# Altium schematic sheet PressureTransducer.SchDoc
size A
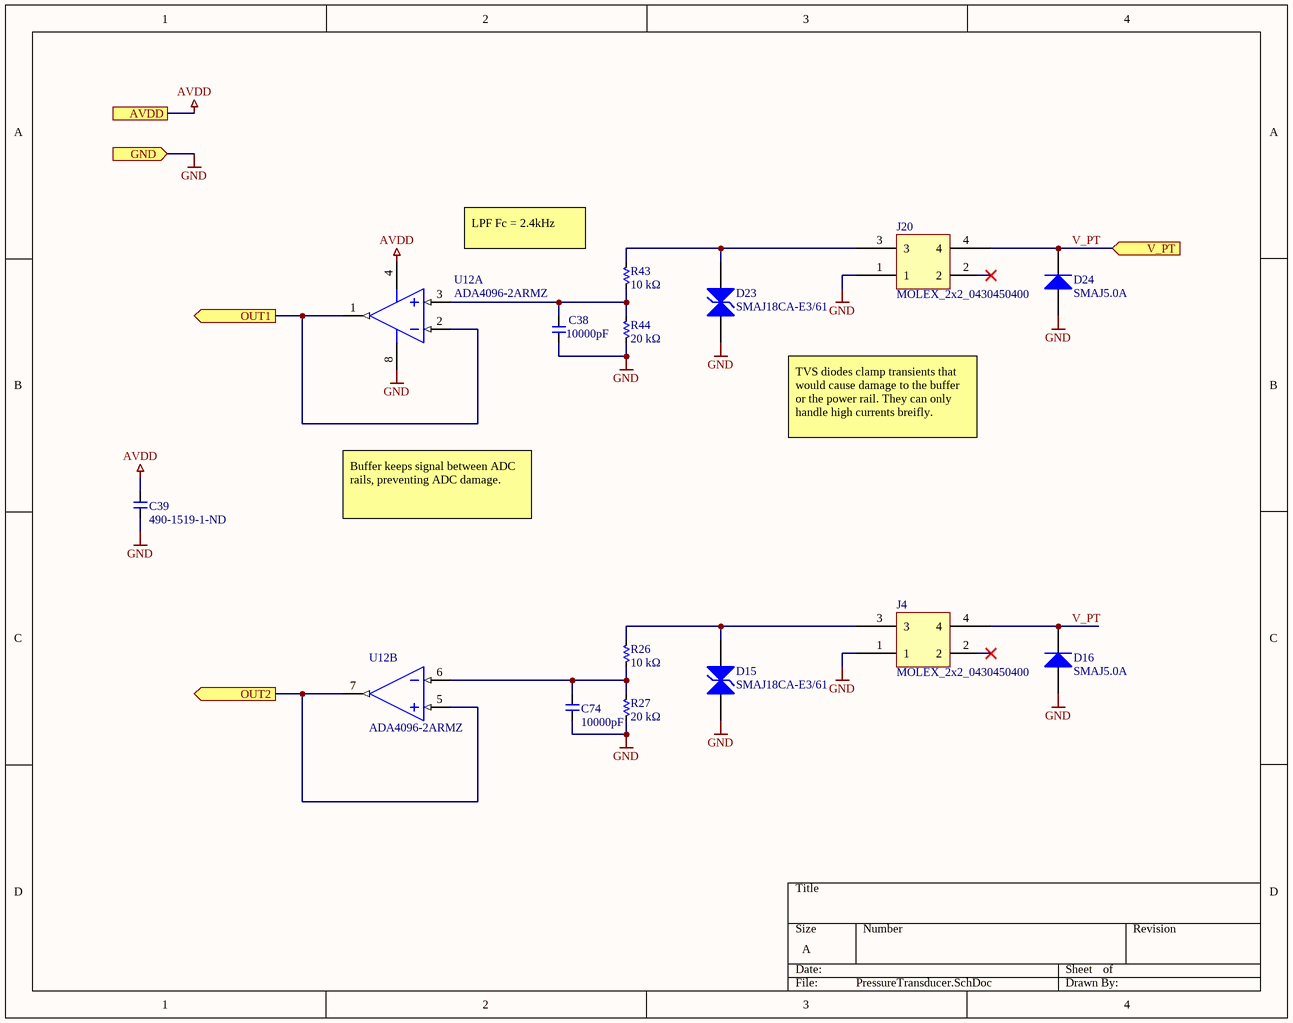
[diagram p0: PressureTransducer.SchDoc]

## Parts
C38  Capacitance (shorthand): 10000pF  [C0603]  (hidden comment: 490-1512-1-ND)
C39  490-1519-1-ND  [C0603]
C74  Capacitance (shorthand): 10000pF  [C0603]  (hidden comment: 490-1512-1-ND)
D15  SMAJ18CA-E3/61  [VISH-DO-214AC-2_M]
D16  SMAJ5.0A  [BOUR-SMA-2_V]
D23  SMAJ18CA-E3/61  [VISH-DO-214AC-2_M]
D24  SMAJ5.0A  [BOUR-SMA-2_V]
J4  MOLEX_2x2_0430450400  [MOLEX_2x2_0430450400]
J20  MOLEX_2x2_0430450400  [MOLEX_2x2_0430450400]
R26  Resistance: 10 kΩ  [R0603]  (hidden comment: 311-10.0KHRCT-ND)
R27  Resistance: 20 kΩ  [R0603]  (hidden comment: 311-20.0KHRCT-ND)
R43  Resistance: 10 kΩ  [R0603]  (hidden comment: 311-10.0KHRCT-ND)
R44  Resistance: 20 kΩ  [R0603]  (hidden comment: 311-20.0KHRCT-ND)
U12  ADA4096-2ARMZ  [ADI-RM-8_M]  (parts A,B of 2)

## Ports
AVDD, GND (in), OUT1 (out), OUT2 (out), V_PT (in)

## Nets
AVDD: C39.1 U12.4(-V) ; port AVDD
GND: C38.2 C39.2 C74.2 D15.1(A1) D16.1(A) D23.1(A1) D24.1(A) J4.1 J20.1 R27.1 R44.1 U12.8(+V) ; port GND
OUT1: U12.1(OUT_A) U12.2(-IN_A) ; port OUT1
OUT2: U12.5(+IN_B) U12.7(OUT_B) ; port OUT2
V_PT: D16.2(K) D24.2(K) J4.4 J20.4 ; port V_PT
NetC38_1: C38.1 R43.1 R44.2 U12.3(+IN_A)
NetC74_1: C74.1 R26.1 R27.2 U12.6(-IN_B)
NetD15_2: D15.2(A2) J4.3 R26.2
NetD23_2: D23.2(A2) J20.3 R43.2

Not connected (* = marked no-connect by the designer): J4 2*; J20 2*

## Notes on the sheet
- LPF Fc = 2.4kHz
- TVS diodes clamp transients that would cause damage to the buffer or the power rail. They can only handle high currents breifly.
- Buffer keeps signal between ADC rails, preventing ADC damage.

## Library data of the parts
C38 C74 = CMP-119-0053-1: CAP CER 0603 10000pF X7R 50V 10%; Manufacturer: Murata Electronics North America; Capacitance - pF (Machine readable): #NAME?; Dielectric: X7R; Rated Voltage: 50V
C39 = CMP-119-0065-1: CAP CER 0603 0.1µF X7R 50V 10%; Manufacturer: Murata Electronics North America; Capacitance - pF (Machine readable): #NAME?; Capacitance (shorthand): 0.1µF; Dielectric: X7R; Rated Voltage: 50V
D15 D23 = CMP-00018-1: Diode TVS Single Bi-Dir 18V 400W 2-Pin SMA T/R; Number of Channels: 1; Max Breakdown Voltage: 22.1V; Direction: Bidirectional; Max Reverse Leakage Current: 1uA; Clamping Voltage: 29.2V; Max Surge Current: 13.7A; Max Forward Surge Current (Ifsm): 40A; Test Current: 1mA; Min Breakdown Voltage: 20V; Power Dissipation: 400W; Lead Free: Lead Free; Max Operating Temperature: 150°C; Weight: 0.064g; Min Operating Temperature: -55°C; Operating Supply Voltage: 18V; Case/Package: DO-214AC; Polarity: Bidirectional; Termination: SMD/SMT; Height: 0.09inch; Width: 0.11inch; Series: SMAJ; Reverse Standoff Voltage: 18V; Clamping Voltage-Max: 29.2V; Max Power Dissipation: 400W; Package Quantity: 1800; Voltage Rating (DC): 18V; REACH SVHC: Unknown; Packaging: Tape and Reel; Radiation Hardening: No; Peak Pulse Current: 13.7A; Length: 0.177inch; Element Configuration: Single; Number of Elements: 1; Leakage Current: 1uA; Peak Pulse Power: 400W; Number of Pins: 2; Reverse Breakdown Voltage: 20V; Contact Plating: Tin,Matte; Breakdown Voltage: 20V
D16 D24 = CMP-00017-1: BOURNS - SMAJ5.0A - TVS Diode, SMAJ Series, Unidirectional, 5 V, 9.2 V, DO-214AC (SMA), 2 Pins; Min Breakdown Voltage: 6.4V; ESD Protection: Yes; Test Current: 10mA; Clamping Voltage: 9.2V; Leakage Current: 800uA; Max Breakdown Voltage: 7V; Number of Unidirectional Channels: 1; Operating Supply Voltage: 3.5V; Peak Pulse Current: 43.5A; Power Line Protection: No; Peak Pulse Power: 400W; Reverse Standoff Voltage: 5V; Diode Type: ZENER; Element Configuration: Single; Max Surge Current: 40A; Height: 2.42mm; Case/Package: DO-214AC; Max Reverse Leakage Current: 800uA; Packaging: Tape and Reel; REACH SVHC: No SVHC; Direction: Unidirectional; Series: SMAJ; Radiation Hardening: No; Mount: Surface Mount; Max Operating Temperature: 150°C; Package Quantity: 1; Width: 2.92mm; Reverse Breakdown Voltage: 6.4V; Number of Channels: 1; Polarity: Unidirectional; Min Operating Temperature: -55°C; Length: 4.57mm; Resistor Type: Zener; Max Power Dissipation: 400W; Number of Pins: 2; Breakdown Voltage: 7V; Number of Elements: 1; Termination: SMD/SMT
J4 J20 = CMP-030-0039-1: MICROFIT CONN HEADER R/A 4POS 3MM; Design Item ID: MOLEX_2x2_0430450400; Source: connector.SchLib
R26 R43 = CMP-126-0273-2: RES SMD 10K OHM 1% 1/10W 0603; Manufacturer Part Number: RC0603FR-0710KL; Manufacturer: Yageo; Resistance (Sortable): 10000; Power (Watts): 0.1W, 1/10W; Temperature Coefficient: ±100ppm/°C; Datasheets: http://www.yageo.com/documents/recent/PYu-RC_Group_51_RoHS_L_9.pdf; Image: //media.digikey.com/Renders/Yageo%20Renders/0603-(1608-Metric).jpg; Tolerance: ±1%; Operating Temperature: -55°C ~ 155°C
R27 R44 = CMP-126-0304-2: RES SMD 20K OHM 1% 1/10W 0603; Manufacturer Part Number: RC0603FR-0720KL; Manufacturer: Yageo; Resistance (Sortable): 20000; Power (Watts): 0.1W, 1/10W; Temperature Coefficient: ±100ppm/°C; Datasheets: http://www.yageo.com/documents/recent/PYu-RC_Group_51_RoHS_L_9.pdf; Image: //media.digikey.com/Renders/Yageo%20Renders/0603-(1608-Metric).jpg; Tolerance: ±1%; Operating Temperature: -55°C ~ 155°C
U12 = CMP-00007-2: Operational Amplifier, Dual, 501 kHz, 2, 0.25 V/ s, 3V to 30V, MSOP, 8 ;RoHS Compliant: Yes; Number of Circuits: 2; Common Mode Rejection Ratio: 77dB; Bandwidth: 501kHz; Amplifier Type: GENERAL PURPOSE; Max Dual Supply Voltage: 15V; Input Capacitance: 7pF; Operating Supply Current: 120uA; -3db Bandwidth: 152kHz; Power Supply Rejection Ratio (PSRR): 100dB; Quiescent Current: 60uA; Gain Bandwidth Product: 786kHz; Unity Gain Bandwidth Product: 550kHz; Input Bias Current: 10nA; Voltage Gain: 111dB; Input Voltage Noise Density: 27nV/sqrt Hz; Min Dual Supply Voltage: 1.5V; Input Offset Voltage (Vos): 300uV; Slew Rate: 0.25V/µs; Output Current per Channel: 10mA; Number of Channels: 2; Case/Package: MSOP; Min Supply Voltage: 3V; Number of Amplifiers: 2; Width: 3.2mm; Packaging: Rail/Tube; Length: 3.2mm; Series: -; Max Operating Temperature: 125°C; Technology: BIPOLAR; REACH SVHC: No SVHC; Height: 0.95mm; Max Supply Voltage: 30V; Number of Pins: 8; Contact Plating: Tin,Matte; Radiation Hardening: No; Package Quantity: 50; Number of Elements: 2; Lead Free: Contains Lead; Min Operating Temperature: -40°C